# EAGLE design Hardware-Neuron (EAGLE 9.3.0)
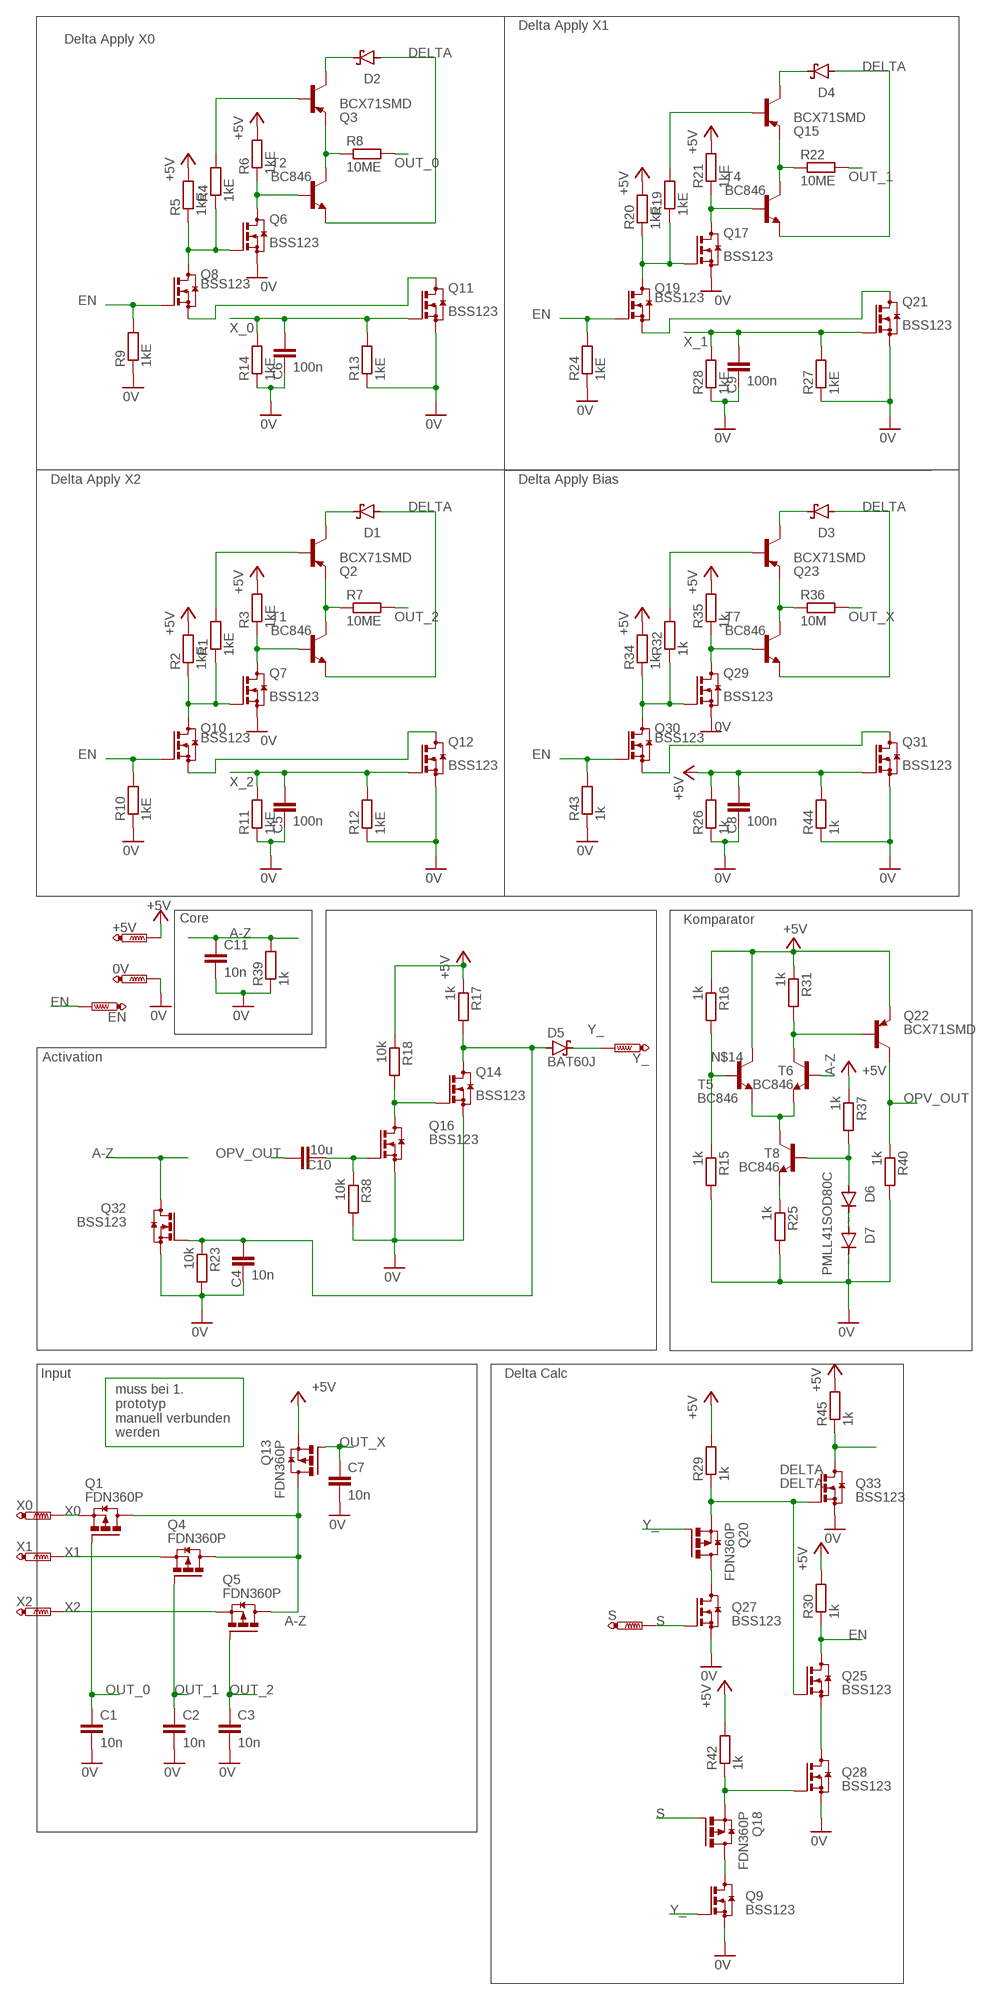
[diagram p0: schematic, sheet 1]

## Parts
0V  PTR1PAD1-17  [P1-17]
+5V  PTR1PAD1-17  [P1-17]
C1  10n  C-EUC0805  [C0805]
C2  10n  C-EUC0805  [C0805]
C3  10n  C-EUC0805  [C0805]
C4  10n  C-EUC0805  [C0805]
C5  100n  C-EUC0805  [C0805]
C6  100n  C-EUC0805  [C0805]
C7  10n  C-EUC0805  [C0805]
C8  100n  C-EUC0805  [C0805]
C9  100n  C-EUC0805  [C0805]
C10  10u  C-EUC0805  [C0805]
C11  10n  C-EUC0805  [C0805]
D1  BAT60J  [SOD323_ST]
D2  BAT60J  [SOD323_ST]
D3  BAT60J  [SOD323_ST]
D4  BAT60J  [SOD323_ST]
D5  BAT60J  [SOD323_ST]
D6  PMLL41SOD80C  [SOD80C]
D7  PMLL41SOD80C  [SOD80C]
EN  PTR1PAD1-17  [P1-17]
Q1  FDN360P  [SUPER-SOT3]
Q2  BCX71SMD  [SOT23]
Q3  BCX71SMD  [SOT23]
Q4  FDN360P  [SUPER-SOT3]
Q5  FDN360P  [SUPER-SOT3]
Q6  BSS123  [SOT23]
Q7  BSS123  [SOT23]
Q8  BSS123  [SOT23]
Q9  BSS123  [SOT23]
Q10  BSS123  [SOT23]
Q11  BSS123  [SOT23]
Q12  BSS123  [SOT23]
Q13  FDN360P  [SUPER-SOT3]
Q14  BSS123  [SOT23]
Q15  BCX71SMD  [SOT23]
Q16  BSS123  [SOT23]
Q17  BSS123  [SOT23]
Q18  FDN360P  [SUPER-SOT3]
Q19  BSS123  [SOT23]
Q20  FDN360P  [SUPER-SOT3]
Q21  BSS123  [SOT23]
Q22  BCX71SMD  [SOT23]
Q23  BCX71SMD  [SOT23]
Q25  BSS123  [SOT23]
Q27  BSS123  [SOT23]
Q28  BSS123  [SOT23]
Q29  BSS123  [SOT23]
Q30  BSS123  [SOT23]
Q31  BSS123  [SOT23]
Q32  BSS123  [SOT23]
Q33  BSS123  [SOT23]
R1  1kE  R-EU_M0805  [M0805]
R2  1kE  R-EU_M0805  [M0805]
R3  1kE  R-EU_M0805  [M0805]
R4  1kE  R-EU_M0805  [M0805]
R5  1kE  R-EU_M0805  [M0805]
R6  1kE  R-EU_M0805  [M0805]
R7  10ME  R-EU_M0805  [M0805]
R8  10ME  R-EU_M0805  [M0805]
R9  1kE  R-EU_M0805  [M0805]
R10  1kE  R-EU_M0805  [M0805]
R11  1kE  R-EU_M0805  [M0805]
R12  1kE  R-EU_M0805  [M0805]
R13  1kE  R-EU_M0805  [M0805]
R14  1kE  R-EU_M0805  [M0805]
R15  1k  R-EU_M0805  [M0805]
R16  1k  R-EU_M0805  [M0805]
R17  1k  R-EU_M0805  [M0805]
R18  10k  R-EU_M0805  [M0805]
R19  1kE  R-EU_M0805  [M0805]
R20  1kE  R-EU_M0805  [M0805]
R21  1kE  R-EU_M0805  [M0805]
R22  10ME  R-EU_M0805  [M0805]
R23  10k  R-EU_M0805  [M0805]
R24  1kE  R-EU_M0805  [M0805]
R25  1k  R-EU_M0805  [M0805]
R26  1k  R-EU_M0805  [M0805]
R27  1kE  R-EU_M0805  [M0805]
R28  1kE  R-EU_M0805  [M0805]
R29  1k  R-EU_M0805  [M0805]
R30  1k  R-EU_M0805  [M0805]
R31  1k  R-EU_M0805  [M0805]
R32  1k  R-EU_M0805  [M0805]
R34  1k  R-EU_M0805  [M0805]
R35  1k  R-EU_M0805  [M0805]
R36  10M  R-EU_M0805  [M0805]
R37  1k  R-EU_M0805  [M0805]
R38  10k  R-EU_M0805  [M0805]
R39  1k  R-EU_M0805  [M0805]
R40  1k  R-EU_M0805  [M0805]
R42  1k  R-EU_M0805  [M0805]
R43  1k  R-EU_M0805  [M0805]
R44  1k  R-EU_M0805  [M0805]
R45  1k  R-EU_M0805  [M0805]
S  PTR1PAD1-17  [P1-17]
T1  BC846  [SOT23]
T2  BC846  [SOT23]
T4  BC846  [SOT23]
T5  BC846  [SOT23]
T6  BC846  [SOT23]
T7  BC846  [SOT23]
T8  BC846  [SOT23]
X0  PTR1PAD1-17  [P1-17]
X1  PTR1PAD1-17  [P1-17]
X2  PTR1PAD1-17  [P1-17]
Y_  PTR1PAD1-17  [P1-17]

## Nets
0V: 0V.TP C1.2 C2.2 C3.2 C4.2 C5.2 C6.2 C7.2 C8.2 C9.2 C11.2 D7.C Q6.2(S) Q7.2(S) Q9.2(S) Q11.2(S) Q12.2(S) Q14.2(S) Q16.2(S) Q17.2(S) Q21.2(S) Q27.2(S) Q28.2(S) Q29.2(S) Q31.2(S) Q32.2(S) Q33.2(S) R9.1 R10.1 R11.1 R12.1 R13.1 R14.1 R15.2 R23.2 R24.1 R25.2 R26.1 R27.1 R28.1 R38.2 R39.1 R40.2 R43.1 R44.1
+5V: +5V.TP C8.1 Q13.2(S) Q22.2(E) Q31.1(G) R2.2 R3.2 R5.2 R6.2 R16.1 R17.1 R18.1 R20.2 R21.2 R26.2 R29.2 R30.2 R31.1 R34.2 R35.2 R37.1 R42.2 R44.2 R45.2 T5.3(C)
A-Z: C11.1 Q1.3(D) Q4.3(D) Q5.3(D) Q13.3(D) Q32.3(D) R39.2 T6.1(B)
DELTA: D1.A D2.A D3.A D4.A Q20.2(S) Q25.1(G) Q33.1(G) R29.1 T1.2(E) T2.2(E) T4.2(E) T7.2(E)
EN: EN.TP Q8.1(G) Q10.1(G) Q19.1(G) Q25.3(D) Q30.1(G) R9.2 R10.2 R24.2 R30.1 R43.2
N$1: Q29.3(D) R35.1 T7.1(B)
N$2: Q23.2(E) R36.1 T7.3(C)
N$3: C10.2 Q16.1(G) R38.1
N$4: Q33.3(D) R45.1
N$5: Q14.1(G) Q16.3(D) R18.2
N$6: Q6.3(D) R6.1 T2.1(B)
N$7: Q8.2(S) Q11.3(D)
N$8: Q3.2(E) R8.1 T2.3(C)
N$9: D3.C Q23.3(C)
N$10: Q23.1(B) R32.2
N$11: Q29.1(G) Q30.3(D) R32.1 R34.1
N$12: Q30.2(S) Q31.3(D)
N$13: D6.C D7.A
N$14: R15.1 R16.2 T5.1(B)
N$16: C4.1 D5.A Q14.3(D) Q32.1(G) R17.2 R23.1
N$17: Q9.3(D) Q18.3(D)
N$25: R25.1 T8.2(E)
N$26: Q22.1(B) R31.2 T6.3(C)
N$27: T5.2(E) T6.2(E) T8.3(C)
N$28: Q17.3(D) R21.1 T4.1(B)
N$29: D6.A R37.2 T8.1(B)
N$31: D2.C Q3.3(C)
N$32: Q20.3(D) Q27.3(D)
N$33: Q15.2(E) R22.1 T4.3(C)
N$34: Q3.1(B) R4.2
N$35: Q6.1(G) Q8.3(D) R4.1 R5.1
N$36: Q18.2(S) Q28.1(G) R42.1
N$38: D4.C Q15.3(C)
N$39: Q15.1(B) R19.2
N$40: Q25.2(S) Q28.3(D)
N$41: Q17.1(G) Q19.3(D) R19.1 R20.1
N$42: Q19.2(S) Q21.3(D)
N$50: Q7.3(D) R3.1 T1.1(B)
N$51: Q2.2(E) R7.1 T1.3(C)
N$52: D1.C Q2.3(C)
N$53: Q2.1(B) R1.2
N$54: Q7.1(G) Q10.3(D) R1.1 R2.1
N$55: Q10.2(S) Q12.3(D)
OPV_OUT: C10.1 Q22.3(C) R40.1
OUT_0: C1.1 Q1.1(G) R8.2
OUT_1: C2.1 Q4.1(G) R22.2
OUT_2: C3.1 Q5.1(G) R7.2
OUT_X: C7.1 Q13.1(G) R36.2
S: Q18.1(G) Q27.1(G) S.TP
X0: Q1.2(S) X0.TP
X1: Q4.2(S) X1.TP
X2: Q5.2(S) X2.TP
X_0: C6.1 Q11.1(G) R13.2 R14.2
X_1: C9.1 Q21.1(G) R27.2 R28.2
X_2: C5.1 Q12.1(G) R11.2 R12.2
Y_: D5.C Q9.1(G) Q20.1(G) Y_.TP

## Notes on the sheet
- Delta Apply X1
- Delta Apply X0
- Delta Apply X2 | Delta Apply Bias
- Core | Komparator
- Activation
- Input | Delta Calc
- muss bei 1.
  prototyp 
  manuell verbunden
  werden

## Library data of the parts
0V +5V EN S X0 X1 X2 Y_ = testpad:PTR1: TEST PIN
C1-C11 = rcl:C-EU: CAPACITOR, European symbol; SPICEPREFIX: C
D1-D5 = diode:BAT60J: Schottky barrier diode Source: www.st.com, BAT60J.pdf
D6 D7 = diode:PMLL41*: High-speed diodes Source: http://www.semiconductors.philips.com/acrobat_download/datasheets/PMLL4150_2.pdf
Q1 Q4 Q5 Q13 Q18 Q20 = transistor-power:FDN360P: Single P-Channel, PowerTrench (R) MOSFET Source: http://www.fairchildsemi.com/ds/FD/FDN360P.pdf
Q2 Q3 Q15 Q22 Q23 = transistor-pnp:BCX71SMD: PNP Transistor
Q6-Q12 Q14 Q16 Q17 Q19 Q21 Q25 Q27-Q33 = transistor-small-signal:BSS123: N-CHANNEL MOS FET
R1-R32 R34-R40 R42-R45 = rcl:R-EU_: RESISTOR, European symbol; SPICEPREFIX: R
T1 T2 T4-T8 = transistor:BC846: NPN TRANSISTOR

## Board
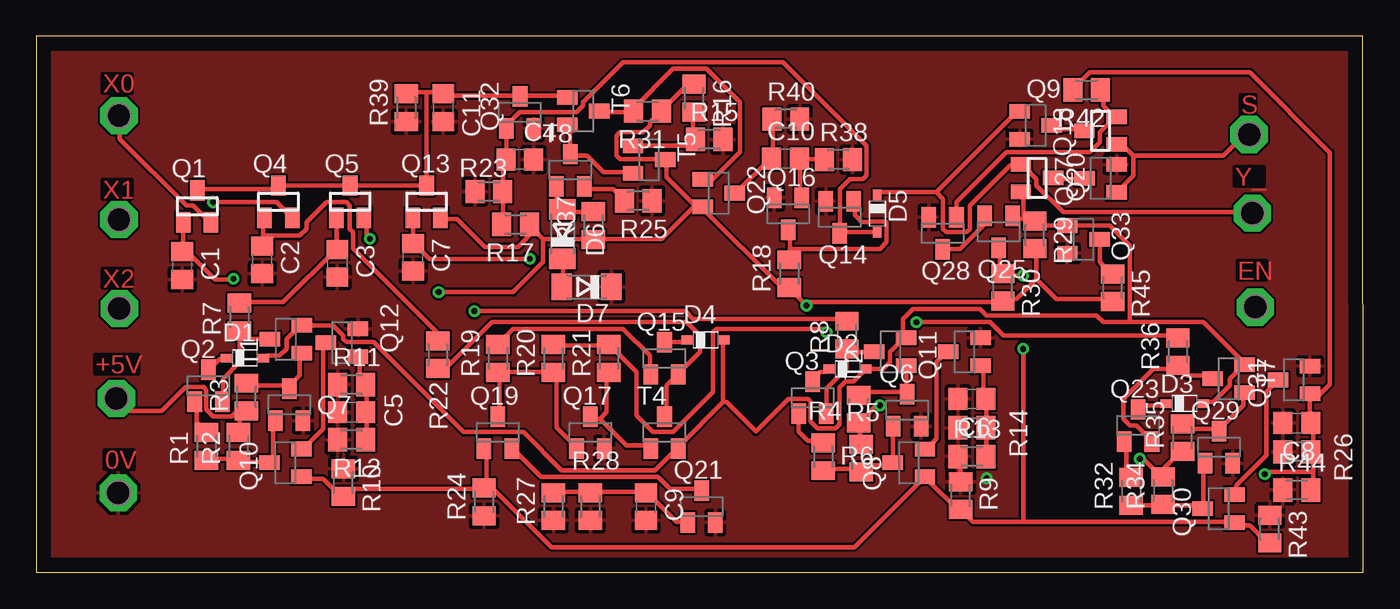
[diagram p1: board, top side]
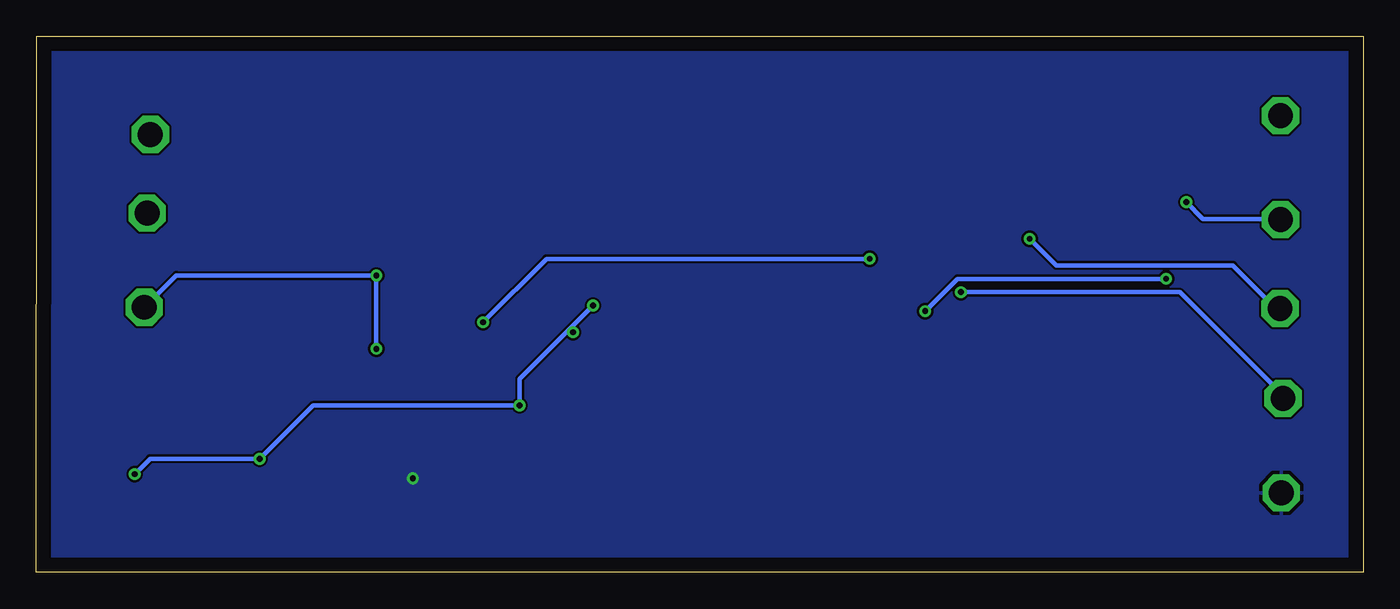
[diagram p2: board, bottom side, seen from below]

Size 90.97 x 36.77 mm. Coordinates in mm from the lower left corner, seen from the top.
Outline: 0,0 90.97,0 90.96,36.77 0,36.77 0,0
Copper layers (1*16): Top 0.035mm / dielectric 1.5mm / Bottom 0.035mm
Design rules "default *": minimum track width 12mil, minimum drill 0.4mm, track to track 6mil, track to pad 6mil, pad to pad 6mil, via to via 6mil, smd to smd 6mil, copper to edge 40mil, drill to drill 6mil, minimum pad ring 10mil, minimum via ring 8mil, stop-mask expansion 4mil, vias tented up to drill 0mil, thermal gap 10mil
tKeepout: area 32.4,33.6 to 55.1,43.4

### Footprints (pad centres in the part's own frame; a part is rotated, then mirrored left to right if it is on the bottom)
P1-17 = drill 1.702 pad 2.54 octagon: TP 0,0
C0805 = smd 1.3 x 1.5: 1 -0.95,0; 2 0.95,0
SOD323_ST = smd 0.8 x 0.6: A 1.25,0; C -1.25,0
SOD80C = smd 1.4 x 1.8: A 1.7,0; C -1.7,0
SUPER-SOT3 = smd 1 x 1.4: 1 -0.95,-1.1; 2 0.95,-1.1; 3 0,1.1
SOT23 = smd 1 x 1.4: 1 -0.95,-1.1; 2 0.95,-1.1; 3 0,1.1
M0805 = smd 1.3 x 1.6: 1 -0.95,0; 2 0.95,0

### Placement (x,y rotation side)
0V  5.61,5.45 0 top
+5V  5.48,11.94 0 top
C1  9.99,21.05 270 top
C2  15.47,21.45 270 top
C3  20.63,21.21 270 top
C4  33.14,28.33 0 top
C5  21.61,10.99 180 top
C6  64.15,11.9 180 top
C7  25.82,21.61 270 top
C8  86.43,10.24 180 top
C9  41.8,4.52 270 top
C10  51.36,28.38 0 top
C11  27.9,31.88 270 top
D1  14.3,14.7 0 top
D2  55.63,13.95 0 top
D3  78.73,11.58 0 top
D4  45.89,15.95 0 top
D5  57.66,24.61 270 top
D6  36.06,23.22 90 top
D7  37.73,19.59 180 top
EN  83.58,18.19 0 top
Q1  11.03,25.11 0 top
Q2  11.8,12.8 0 top
Q3  53.22,11.99 0 top
Q4  16.59,25.43 0 top
Q5  21.51,25.43 0 top
Q6  59.71,11.12 0 top
Q7  17.33,11.5 0 top
Q8  59.83,7.52 90 top
Q9  68.53,30.66 270 top
Q10  17.07,7.52 90 top
Q11  63.64,15.14 90 top
Q12  20.95,15.76 90 top
Q13  26.75,25.43 0 top
Q14  55.08,24.37 180 top
Q15  43.07,14.68 0 top
Q16  51.54,24.6 180 top
Q17  37.99,9.6 0 top
Q18  72.96,30.3 90 top
Q19  31.64,9.6 0 top
Q20  68.61,27.05 270 top
Q21  45.61,4.52 0 top
Q22  46.8,26.02 270 top
Q23  75.54,10.08 0 top
Q25  65.99,23.37 180 top
Q27  72.98,27.04 90 top
Q28  62.14,23.26 180 top
Q29  81.09,8.59 0 top
Q30  81.07,4.37 90 top
Q31  86.23,13.2 90 top
Q32  33.16,31.56 0 top
Q33  71.8,22.84 270 top
R1  11.66,8.65 90 top
R2  13.86,8.65 90 top
R3  14.41,12.03 270 top
R4  53.95,7.93 90 top
R5  56.57,7.83 90 top
R6  56.4,11.2 270 top
R7  13.91,17.53 90 top
R8  55.58,16.28 90 top
R9  63.37,5.27 270 top
R10  21.05,6.15 270 top
R11  21.61,12.88 0 top
R12  21.61,9.09 0 top
R13  64.15,7.95 0 top
R14  64.15,9.92 0 top
R15  46.13,29.7 0 top
R16  45.1,32.54 270 top
R17  32.85,23.87 180 top
R18  51.61,20.49 90 top
R19  31.64,14.68 90 top
R20  35.45,14.68 90 top
R21  39.26,14.68 90 top
R22  27.52,14.92 90 top
R23  31.02,26.13 180 top
R24  30.69,4.84 90 top
R25  41.28,25.49 0 top
R26  86.43,8.27 0 top
R27  35.45,4.52 90 top
R28  37.99,4.52 90 top
R29  68.47,23.16 270 top
R30  66.27,19.56 270 top
R31  41.91,31.64 180 top
R32  75.08,5.56 90 top
R34  77.26,5.6 90 top
R35  78.59,9.24 270 top
R36  78.27,15.14 90 top
R37  38.2,23.79 90 top
R38  55,28.32 0 top
R39  25.36,31.88 90 top
R40  51.39,31.1 0 top
R42  72.01,33.1 180 top
R43  84.58,2.97 270 top
R44  86.43,5.65 0 top
R45  73.81,19.52 270 top
S  83.16,30.04 0 top
T1  17.1,15.99 90 top
T2  58.56,15.14 90 top
T4  43.07,9.6 0 top
T5  42.01,28.31 270 top
T6  37.5,31.64 270 top
T7  81.76,13.28 90 top
T8  36.61,27.6 0 top
X0  5.66,31.33 0 top
X1  5.66,24.2 0 top
X2  5.69,18.11 0 top
Y_  83.39,24.65 0 top

### Tracks (layer width: path | path; a pad name or v marks a point on that pad's centre or on a via)
0V  (via drill 0.4)
  Top 0.305: R13.1 63.37,7.95 R9.1
  other vias: 65.16,6.45
  pour Bottom: 0,36.77 90.97,36.77 90.97,0 0,0
  pour Top: -0.32,0 90.97,0 90.97,36.77 -0.32,36.77
+5V  (via drill 0.4)
  Top 0.305: 87.55,6.88 87.55,8.25 R26.2 87.55,8.48 87.55,10.08 C8.1 87.33,10.31 87.33,12.14 | 87.55,6.88 87.55,5.74 R44.2 | 87.33,12.14 Q31.1 87.33,12.36 | R42.2 71.09,33.17 72.24,34.31 83.21,34.31 88.71,28.81 88.71,12.9 87.94,12.14 87.33,12.14 | R2.2 13.95,9.62 13.95,10.54 14.4,10.99 R3.2 13.76,11.08 13.38,10.7 12.12,10.7 11.65,11.17 11.65,12.53 11.48,12.71 10.22,12.71 8.6,11.08 6.32,11.08 5.49,11.91 +5V.TP | 34.16,23.47 33.01,22.33 30.77,22.33 28.84,24.25 27.89,24.25 Q13.2 | 34.75,22.88 38.18,22.88 R37.1 38.41,22.88 42.87,22.88 45.16,25.17 | 34.16,23.47 33.83,23.79 R17.1 | 34.16,23.47 34.75,22.88 | 68.58,20.14 67.21,18.77 66.29,18.77 R30.2 66.06,18.54 52.58,18.54 | 68.58,20.14 68.58,22.19 R29.2 | 68.58,20.14 69.95,18.77 73.61,18.77 R45.2 | R16.1 45.03,33.4 44.58,33.4 42.98,31.8 R31.1 42.75,31.57 42.06,30.88 42.06,30.65 41.6,30.2 40.01,30.2 39.78,29.97 39.78,28.6 40.01,28.37 42.98,28.37 T5.3 43.2,28.14 43.2,27.13 45.16,25.17 | R20.2 35.66,15.57 39.09,15.57 R21.2 39.32,15.57 41.15,13.74 41.15,10.76 42.29,9.62 43.66,9.62 46.41,12.36 46.41,16.48 46.63,16.71 53.95,16.71 v54.18,16.48 | R35.2 78.41,8.25 77.27,7.11 77.27,6.65 R34.2 77.04,6.65 75.89,7.79 v75.67,7.79 | R5.2 56.46,8.94 56.46,10.08 R6.2 56.46,10.31 57.61,11.45 v57.84,11.45 | 45.16,25.17 45.56,25.14 Q22.2 45.72,24.94 50.98,19.68 51.44,19.68 R18.1 51.66,19.45 52.58,18.54 | 52.58,18.54 v52.81,18.31 | v27.58,19.22 32.69,19.22 34.75,21.28 34.75,22.88 | 87.55,6.88 84.39,6.88 v84.25,6.74
  Bottom 0.305: v52.81,18.31 54.41,16.71 | 54.41,16.71 57.84,13.28 v57.84,11.45 72.01,11.45 v75.67,7.79 83.19,7.79 v84.25,6.74 | 54.41,16.71 v54.18,16.48 | v27.58,19.22 12.57,19.22 5.49,12.14 +5V.TP
A-Z
  Top 0.305: 26.75,32.94 25.38,32.94 R39.2 | 26.75,32.94 27.89,32.94 C11.1 28.12,32.71 33.15,32.71 Q32.3 33.38,32.71 36.35,32.71 T6.1 | Q1.3 11.2,26.31 16.46,26.31 Q4.3 16.69,26.54 21.49,26.54 Q5.3 21.72,26.54 Q13.3 | Q13.3 26.75,32.94 | Q13.3
DELTA
  Top 0.305: D1.A 15.77,14.88 16.69,14.88 17.14,15.34 17.14,16.02 18.06,16.94 T1.2 18.29,16.94 20.34,16.94 21.03,16.25 21.03,16.02 21.26,15.79 23.13,15.79 29.3,9.62 33.42,9.62 36.02,7.01 42.43,7.01 43.89,8.48 T4.2 44.12,8.71 47.09,11.68 | 47.09,11.68 47.09,15.79 D4.A | 67.67,24.25 68.35,24.25 R29.1 68.58,24.02 68.81,23.79 70.64,23.79 Q33.1 70.87,23.79 73.61,23.79 74.98,22.42 74.98,17.17 | 67.67,24.25 66.98,24.25 Q25.1 | 67.67,24.25 67.67,26.08 Q20.2 | D3.A 80.01,11.68 80.7,11.68 81.84,12.82 81.84,13.28 82.75,14.19 T7.2 82.75,14.42 80.01,17.17 74.98,17.17 | 74.98,17.17 73.15,17.17 72.69,17.62 65.15,17.62 64.69,18.08 60.12,18.08 59.44,17.39 59.44,16.25 T2.2 59.44,16.02 58.52,15.11 58.52,14.42 58.06,13.97 56.89,13.97 D2.A 56.03,13.1 55.47,13.1 55.06,12.69 55.06,10.13 55.04,10.13 54.8,9.88 53.54,9.88 53.08,10.35 53.08,11.71 52.9,11.89 51.57,11.89 49.34,9.67 47.33,11.68 47.09,11.68
EN  (via drill 0.4)
  Top 0.305: Q25.3 66.06,22.19 66.06,20.59 R30.1 66.29,20.37 v67.67,20.37 | Q19.1 30.86,8.48 30.86,5.96 R24.2 | Q10.1 18.29,6.42 19.66,6.42 21.03,5.05 R10.2 21.26,5.28 21.72,5.74 30.63,5.74 R24.2 | R43.2 84.35,2.08 83.21,3.22 82.3,3.22 Q30.1 82.07,3.45 67.67,3.45 | 67.67,3.45 64.24,3.45 63.55,4.14 R9.2 63.32,4.14 61.04,6.42 Q8.1 60.81,6.42 56.11,1.73 35.33,1.73 31.32,5.74 30.86,5.74 R24.2 | 67.67,3.45 v67.67,15.34
  Bottom 0.305: EN.TP 83.44,18.31 81.38,20.37 v67.67,20.37 v67.67,15.34
N$1
  Top 0.305: R35.1 78.64,10.08 78.87,9.85 80.92,9.85 Q29.3 81.15,9.85 82.75,11.45 82.75,12.14 T7.1
N$2
  Top 0.305: Q23.2 76.35,9.16 75.44,10.08 74.98,10.08 74.52,10.54 74.52,11.91 76.58,13.97 78.18,13.97 R36.1 78.41,13.97 78.87,13.51 80.47,13.51 T7.3
N$3
  Top 0.305: 52.35,28.37 52.35,25.85 Q16.1 | 52.35,28.37 53.95,28.37 R38.1 | 52.35,28.37 C10.2
N$4
  Top 0.305: Q33.3 72.92,22.65 72.92,21.28 73.61,20.59 R45.1
N$5
  Top 0.305: 51.66,22.19 51.66,21.51 R18.2 | 51.66,22.19 51.66,23.34 Q16.3 | 51.66,22.19 57.84,22.19 58.29,22.65 58.29,24.02 58.13,24.02 58.09,24.06 57.23,24.06 57.2,24.02 56.62,24.02 56.13,24.52 56.13,25.37 Q14.1 56.24,25.4
N$6
  Top 0.305: 59.66,12.36 59.66,13.97 T2.1 | 59.66,12.36 56.46,12.36 R6.1 | 59.66,12.36 Q6.3
N$7
  Top 0.305: Q8.2 61.04,8.48 61.72,9.16 61.72,14.42 62.41,15.11 Q11.3
N$8
  Top 0.305: Q3.2 54.18,10.99 54.18,12.62 55.55,13.99 55.55,15.11 R8.1 55.78,15.11 57.38,15.11 T2.3
N$9
  Top 0.305: D3.C 77.27,11.45 75.89,11.45 75.67,11.22 Q23.3
N$10
  Top 0.305: Q23.1 74.75,8.94 74.75,6.88 74.98,6.65 R32.2
N$11
  Top 0.305: Q29.1 80.01,7.34 80.01,4.59 Q30.3 79.78,4.59 77.27,4.59 R34.1 77.04,4.59 75.21,4.59 R32.1
N$12
  Top 0.305: Q30.2 82.3,5.51 82.3,5.96 84.35,8.02 84.35,12.36 85.04,13.05 Q31.3
N$13
  Top 0.305: D7.A 36.12,19.68 36.12,21.51 D6.C
N$14
  Top 0.305: T5.1 40.92,29.28 44.81,29.28 45.03,29.51 R15.1 45.03,29.74 45.03,31.57 R16.2
N$16
  Top 0.305: R17.2 32,24.02 32,26.08 R23.1 32,26.31 32,28.17 C4.1 32.23,28.51 32.23,30.42 Q32.1 32.23,30.65 33.15,31.57 37.03,31.57 37.49,32.02 37.49,32.25 40.23,35 51.21,35 56.92,29.28 56.92,27.22 56.69,27 55.78,27 55.09,26.31 55.09,23.34 | 55.09,23.34 57.61,23.34 D5.A | 55.09,23.34 Q14.3
N$17
  Top 0.305: Q18.3 71.78,30.42 69.95,30.42 69.72,30.65 Q9.3
N$25
  Top 0.305: T8.2 37.72,26.31 39.55,26.31 40.23,25.62 R25.1
N$26
  Top 0.305: Q22.1 45.72,27 46.41,27 48.23,28.82 48.23,32.25 45.95,34.54 43.66,34.54 40.92,31.8 R31.2 40.92,31.57 38.63,31.57 T6.3
N$27
  Top 0.305: T6.2 36.58,30.65 36.58,28.82 T8.3 36.8,28.6 37.75,28.6 38.89,27.45 40.69,27.45 T5.2
N$28
  Top 0.305: 38.63,10.54 40.46,8.71 42.06,8.71 T4.1 | 38.63,10.54 38.18,10.54 Q17.3 | 38.63,10.54 39.09,10.99 39.09,13.51 R21.1
N$29
  Top 0.305: T8.1 35.66,26.31 35.66,25.17 35.89,24.94 D6.A 36.12,24.71 38.18,24.71 R37.2
N$31
  Top 0.305: D2.C 54.13,13.74 53.72,13.74 53.26,13.28 Q3.3
N$32
  Top 0.305: Q27.3 71.78,27 69.72,27 Q20.3
N$33
  Top 0.305: T4.3 43.2,10.76 43.2,12.82 43.89,13.51 Q15.2 44.12,13.74 45.49,15.11 45.49,16.25 44.58,17.17 31.25,17.17 28.28,14.19 27.66,14.19 R22.1
N$34
  Top 0.305: 52.35,10.76 Q3.1 52.27,9.66 52.9,9.03 53.8,9.03 R4.2 53.99,8.93
N$35
  Top 0.305: Q6.1 58.75,9.85 58.75,7.56 Q8.3 58.52,7.34 56.92,7.34 56.69,7.11 R5.1 56.46,7.11 54,7.11 R4.1
N$36
  Top 0.305: Q28.1 63.09,24.48 63.09,25.4 66.52,28.82 72.24,28.82 72.92,29.51 72.92,30.2 73.84,31.11 Q18.2 73.84,31.34 73.15,32.02 73.15,32.94 R42.1
N$38
  Top 0.305: D4.C 44.58,15.79 43.2,15.79 Q15.3
N$39
  Top 0.305: Q15.1 42.06,13.74 42.06,14.88 40.23,16.71 32.69,16.71 31.77,15.79 R19.2
N$40
  Top 0.305: Q28.3 62.18,22.19 63.32,22.19 64.92,23.79 64.92,24.25 Q25.2
N$41
  Top 0.305: Q19.3 31.77,10.76 31.77,13.51 R19.1 31.77,13.74 35.43,13.74 R20.1 35.66,13.51 35.66,9.96 37.04,8.58 Q17.1
N$42
  Top 0.305: Q21.3 45.49,5.74 43.43,5.74 42.61,6.56 34.61,6.56 32.69,8.48 Q19.2
N$50
  Top 0.305: R3.1 14.63,12.82 17.14,12.82 Q7.3 17.37,12.82 18.06,13.51 18.06,14.88 T1.1
N$51
  Top 0.305: 13.95,16.02 13.95,16.48 R7.1 13.95,16.02 | 13.95,16.02 13.95,14.42 12.8,13.28 12.8,11.91 Q2.2 | 13.95,16.02 15.77,16.02 T1.3
N$52
  Top 0.305: D1.C 13.03,14.65 12.57,14.65 11.89,13.97 Q2.3
N$53
  Top 0.305: Q2.1 10.97,11.68 10.97,10.31 11.66,9.62 R1.2
N$54
  Top 0.305: Q7.1 16.23,10.31 16.23,7.79 16,7.56 Q10.3 15.77,7.56 13.95,7.56 R2.1 13.72,7.79 11.89,7.79 R1.1
N$55
  Top 0.305: Q10.2 18.29,8.48 19.66,9.85 19.66,15.57 Q12.3
OPV_OUT
  Top 0.305: Q22.3 48.01,26.08 50.29,28.37 C10.1 50.52,28.6 50.52,30.88 R40.1
OUT_0  (via drill 0.4)
  Top 0.305: Q1.1 10.06,23.79 10.06,22.19 C1.1 10.64,21.71 12.25,20.1 13.46,20.1 v13.5,20.14 | v30.03,17.92 44.51,17.92 45.03,17.39 55.55,17.39 R8.2 | v30.03,17.92
  Bottom 0.305: v30.03,17.92 27.81,20.14 v13.5,20.14
OUT_1
  Top 0.305: 15.54,23.11 15.54,22.42 C2.1 | 15.54,23.11 15.54,24.25 Q4.1 | 15.54,23.11 18.06,23.11 18.52,23.57 18.52,24.02 19.89,25.4 21.26,25.4 21.49,25.17 21.49,23.57 21.72,23.34 21.72,22.2 27.43,16.49 27.43,16.02 R22.2
OUT_2
  Top 0.305: 20.57,22.19 20.57,24.25 Q5.1 | 20.57,22.19 16.92,18.54 13.95,18.54 R7.2 | 20.57,22.19 C3.1
OUT_X  (via drill 0.4)
  Top 0.305: 25.83,22.65 25.83,24.25 Q13.1 | v60.35,17.17 65.38,17.17 66.29,16.25 78.18,16.25 R36.2 | v33.83,21.51 26.98,21.51 25.83,22.65 | 25.83,22.65 C7.1
  Bottom 0.305: v60.35,17.17 56.01,21.51 v33.83,21.51
S
  Top 0.305: 75.21,28.6 74.52,29.28 74.07,29.28 Q18.1 | 75.21,28.6 75.21,27.22 74.3,26.31 Q27.1 | 75.21,28.6 81.38,28.6 82.98,30.2 S.TP
X0
  Top 0.305: Q1.2 11.89,24.02 10.74,25.17 10.29,25.17 5.71,29.74 5.71,31.11 X0.TP
X1  (via drill 0.4)
  Top 0.305: v12.12,25.4 16.46,25.4 17.37,24.48 Q4.2
  Bottom 0.305: v12.12,25.4 10.97,24.25 5.71,24.25 X1.TP
X2  (via drill 0.4)
  Top 0.305: v22.86,22.88 22.63,23.11 22.63,24.25 Q5.2
  Bottom 0.305: v22.86,22.88 21.03,21.05 8.91,21.05 6.17,18.31 5.71,18.31 X2.TP
X_0
  Top 0.305: R13.2 65.15,8.02 65.15,9.85 R14.2 65.15,10.08 65.15,11.68 C6.1 64.92,11.91 64.92,13.97 Q11.1
X_1
  Top 0.305: R27.2 35.66,5.51 37.95,5.51 R28.2 38.18,5.51 41.6,5.51 C9.1 41.83,5.51 43.89,3.45 44.58,3.45 Q21.1
X_2
  Top 0.305: R12.2 22.63,9.16 22.63,10.76 C5.1 22.63,10.99 22.63,12.82 R11.2 22.4,13.05 22.17,13.28 22.17,14.65 Q12.1
Y_
  Top 0.305: 61.72,26.08 57.84,26.08 D5.C | 61.72,26.08 67.21,31.57 Q9.1 | 61.72,26.08 62.18,25.62 62.18,23.57 62.41,23.34 63.78,23.34 64.01,23.57 64.01,25.17 66.75,27.91 67.44,27.91 Q20.1 67.67,27.91 68.58,27 68.58,26.54 70.41,24.71 83.21,24.71 Y_.TP

### Text on the board
Document: Vergleicher und Komparator | Delta Calc | Input | Delta Apply X2 | Delta Apply X1 | Delta Apply X0 | Delta Apply Bias